# Altium schematic sheet LCD.SchDoc
size A4
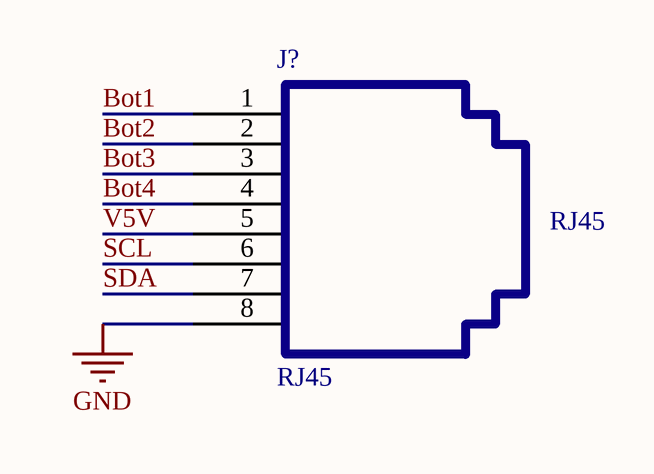
[diagram p0: LCD.SchDoc]

## Parts
J?  RJ45  [RJ45 PLUG]

## Nets
GND: J?.8 J?.9
Bot1: J?.1
Bot2: J?.2
Bot3: J?.3
Bot4: J?.4
SCL: J?.6
SDA: J?.7
V5V: J?.5

## Library data of the parts
J? = RJ45: Modular Connectors / Ethernet Connectors 8 PCB TOP ENTRY; Manufacturer: TE Connectivity / AMP; Manufacturer Part Number: 5556416-1; Mounting Angle: Vertical; Number of Positions: 8 Position; Shielding: Unshielded; Number of Ports: 1; Performance Category: Cat 3; Supplier 1: Mouser; RoHS: RoHS Compliant; Category: Modular Connectors / Ethernet Connectors; Stock 1: 28811; Pricing 1: 1=1.89, 25=1.79, 50=1.71, 100=1.63, 200=1.48, 500=1.33, 1000=1.18, 2000=1.07, 5000=1.04 (AUD); Color: Black; Contact Plating: Gold; Housing Material: Polybutylene Terephthalate (PBT); Packaging: Tray; Series: 555; Termination Style: Through Hole; Brand: TE Connectivity / AMP; Contact Material: Phosphor Bronze; Flammability Rating: UL 94 V-0; Product Category: Modular Jacks; Standard Pack Qty: 152; USOC Codes: RJ45; RoHS - Mouser: Y; Minimum Order Quantity: 1; Reeling: False; ComponentLink1URL: http://www.mouser.com/ds/2/418/NG_CD_5556416_C1-628847.pdf; ComponentLink1Description: http://www.mouser.com/ds/2/418/NG_CD_5556416_C1-628847.pdf; Supplier Part Number 1: 571-5556416-1